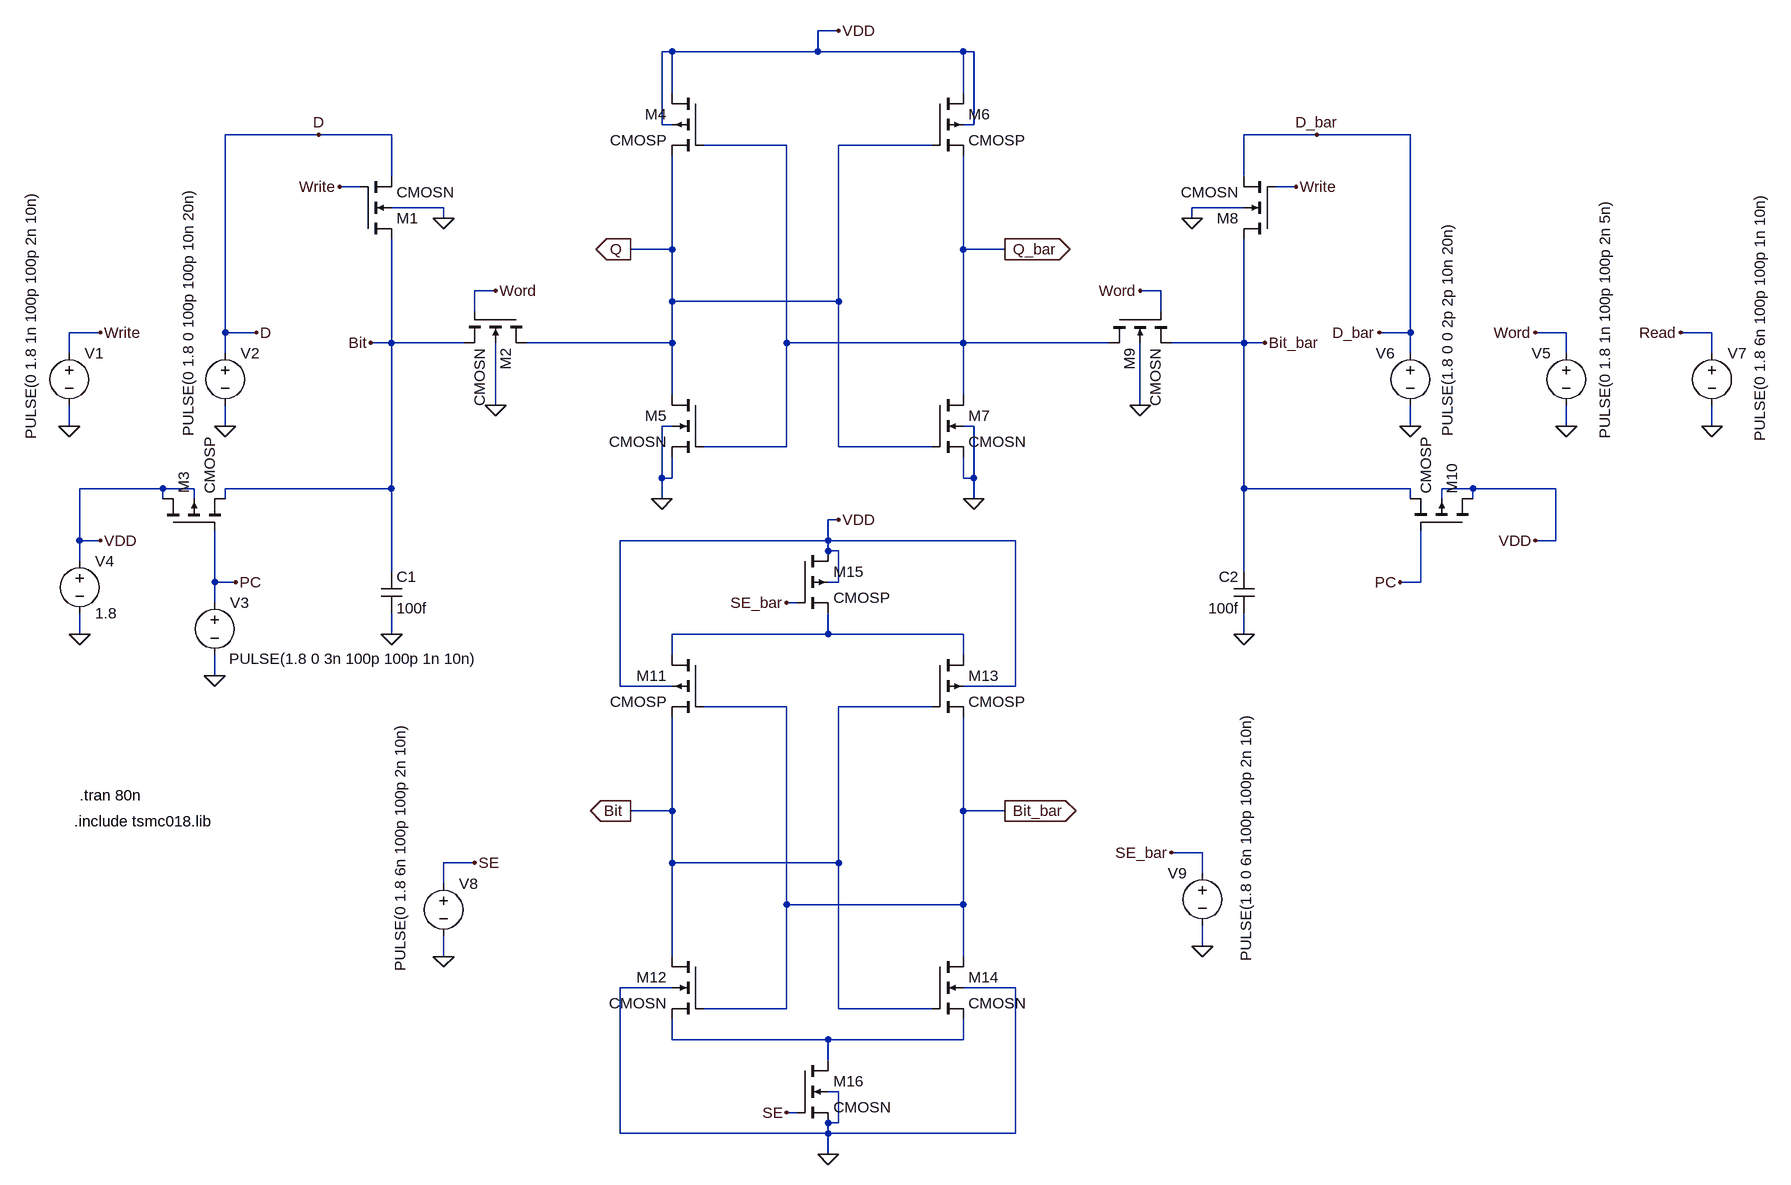
[diagram p0: schematic 1-bit_6T_SRAM_Cell_with_Sense_Amplifier.asc]
1-bit_6T_SRAM_Cell_with_Sense_Amplifier.asc, the LTspice schematic file:
Version 4.1
SHEET 1 2708 1256
WIRE 928 -640 896 -640
WIRE 672 -608 656 -608
WIRE 896 -608 896 -640
WIRE 896 -608 672 -608
WIRE 1120 -608 896 -608
WIRE 1136 -608 1120 -608
WIRE 672 -544 672 -608
WIRE 1120 -544 1120 -608
WIRE 656 -496 656 -608
WIRE 672 -496 656 -496
WIRE 1136 -496 1136 -608
WIRE 1136 -496 1120 -496
WIRE 128 -480 -16 -480
WIRE 240 -480 128 -480
WIRE 1664 -480 1552 -480
WIRE 1808 -480 1664 -480
WIRE 848 -464 720 -464
WIRE 1072 -464 928 -464
WIRE 240 -416 240 -480
WIRE 1552 -416 1552 -480
WIRE 192 -400 160 -400
WIRE 1632 -400 1600 -400
WIRE 320 -368 240 -368
WIRE 1552 -368 1472 -368
WIRE 320 -352 320 -368
WIRE 1472 -352 1472 -368
WIRE 672 -304 672 -448
WIRE 672 -304 608 -304
WIRE 1120 -304 1120 -448
WIRE 1184 -304 1120 -304
WIRE 400 -240 368 -240
WIRE 1424 -240 1392 -240
WIRE 672 -224 672 -304
WIRE 928 -224 928 -464
WIRE 928 -224 672 -224
WIRE 368 -208 368 -240
WIRE 1424 -208 1424 -240
WIRE -208 -176 -256 -176
WIRE -16 -176 -16 -480
WIRE 32 -176 -16 -176
WIRE 1808 -176 1808 -480
WIRE 1808 -176 1760 -176
WIRE 2048 -176 2000 -176
WIRE 2272 -176 2224 -176
WIRE 240 -160 240 -320
WIRE 240 -160 208 -160
WIRE 352 -160 240 -160
WIRE 672 -160 672 -224
WIRE 672 -160 448 -160
WIRE 848 -160 848 -464
WIRE 1120 -160 1120 -304
WIRE 1120 -160 848 -160
WIRE 1344 -160 1120 -160
WIRE 1552 -160 1552 -320
WIRE 1552 -160 1440 -160
WIRE 1584 -160 1552 -160
WIRE -256 -144 -256 -176
WIRE -16 -144 -16 -176
WIRE 1808 -144 1808 -176
WIRE 2048 -144 2048 -176
WIRE 2272 -144 2272 -176
WIRE 672 -80 672 -160
WIRE 1120 -80 1120 -160
WIRE 400 -64 400 -160
WIRE 1392 -64 1392 -160
WIRE -256 -32 -256 -64
WIRE -16 -32 -16 -64
WIRE 672 -32 656 -32
WIRE 1136 -32 1120 -32
WIRE 1808 -32 1808 -64
WIRE 2048 -32 2048 -64
WIRE 2272 -32 2272 -64
WIRE 848 0 848 -160
WIRE 848 0 720 0
WIRE 928 0 928 -224
WIRE 1072 0 928 0
WIRE 656 48 656 -32
WIRE 672 48 672 16
WIRE 672 48 656 48
WIRE 1120 48 1120 16
WIRE 1136 48 1136 -32
WIRE 1136 48 1120 48
WIRE -112 64 -240 64
WIRE -64 64 -112 64
WIRE 240 64 240 -160
WIRE 240 64 -16 64
WIRE 1552 64 1552 -160
WIRE 1808 64 1552 64
WIRE 1904 64 1856 64
WIRE 2032 64 1904 64
WIRE -112 80 -112 64
WIRE -64 80 -64 64
WIRE -16 80 -16 64
WIRE 656 80 656 48
WIRE 1136 80 1136 48
WIRE 1808 80 1808 64
WIRE 1856 80 1856 64
WIRE 1904 80 1904 64
WIRE 928 112 912 112
WIRE -240 144 -240 64
WIRE -208 144 -240 144
WIRE 912 144 912 112
WIRE 912 144 592 144
WIRE 1200 144 912 144
WIRE 2032 144 2032 64
WIRE 2032 144 2000 144
WIRE 912 160 912 144
WIRE 928 160 912 160
WIRE -240 176 -240 144
WIRE 240 192 240 64
WIRE 1552 192 1552 64
WIRE -32 208 -32 128
WIRE 0 208 -32 208
WIRE 928 208 928 160
WIRE 928 208 912 208
WIRE 1824 208 1824 128
WIRE 1824 208 1792 208
WIRE -32 240 -32 208
WIRE 864 240 848 240
WIRE -240 288 -240 256
WIRE 240 288 240 256
WIRE 912 288 912 256
WIRE 912 288 672 288
WIRE 1120 288 912 288
WIRE 1552 288 1552 256
WIRE 672 320 672 288
WIRE 1120 320 1120 288
WIRE -32 352 -32 320
WIRE 592 368 592 144
WIRE 672 368 592 368
WIRE 1200 368 1200 144
WIRE 1200 368 1120 368
WIRE 848 400 720 400
WIRE 1072 400 928 400
WIRE 672 560 672 416
WIRE 672 560 608 560
WIRE 1120 560 1120 416
WIRE 1184 560 1120 560
WIRE 1488 624 1440 624
WIRE 368 640 320 640
WIRE 672 640 672 560
WIRE 928 640 928 400
WIRE 928 640 672 640
WIRE 1488 656 1488 624
WIRE 320 672 320 640
WIRE 848 704 848 400
WIRE 1120 704 1120 560
WIRE 1120 704 848 704
WIRE 1488 768 1488 736
WIRE 320 784 320 752
WIRE 672 784 672 640
WIRE 1120 784 1120 704
WIRE 672 832 592 832
WIRE 1200 832 1120 832
WIRE 848 864 848 704
WIRE 848 864 720 864
WIRE 928 864 928 640
WIRE 1072 864 928 864
WIRE 672 912 672 880
WIRE 912 912 672 912
WIRE 1120 912 1120 880
WIRE 1120 912 912 912
WIRE 912 944 912 912
WIRE 928 992 912 992
WIRE 864 1024 848 1024
WIRE 928 1040 928 992
WIRE 928 1040 912 1040
WIRE 592 1056 592 832
WIRE 912 1056 912 1040
WIRE 912 1056 592 1056
WIRE 1200 1056 1200 832
WIRE 1200 1056 912 1056
WIRE 912 1088 912 1056
FLAG -208 -176 Write
FLAG 32 -176 D
FLAG -256 -32 0
FLAG -16 -32 0
FLAG 160 -400 Write
FLAG 320 -352 0
FLAG 128 -480 D
FLAG 400 -64 0
FLAG 400 -240 Word
FLAG -240 288 0
FLAG -32 352 0
FLAG 240 288 0
FLAG 0 208 PC
FLAG -208 144 VDD
FLAG 656 80 0
FLAG 1136 80 0
FLAG 608 -304 Q
IOPIN 608 -304 Out
FLAG 1184 -304 Q_bar
IOPIN 1184 -304 Out
FLAG 928 -640 VDD
FLAG 2000 -176 Word
FLAG 1760 -176 D_bar
FLAG 2048 -32 0
FLAG 1808 -32 0
FLAG 1632 -400 Write
FLAG 1472 -352 0
FLAG 1664 -480 D_bar
FLAG 1392 -64 0
FLAG 1392 -240 Word
FLAG 1552 288 0
FLAG 1792 208 PC
FLAG 2000 144 VDD
FLAG 2272 -32 0
FLAG 2224 -176 Read
FLAG 208 -160 Bit
FLAG 1584 -160 Bit_bar
FLAG 608 560 Bit
IOPIN 608 560 Out
FLAG 1184 560 Bit_bar
IOPIN 1184 560 Out
FLAG 848 240 SE_bar
FLAG 928 112 VDD
FLAG 848 1024 SE
FLAG 912 1088 0
FLAG 320 784 0
FLAG 368 640 SE
FLAG 1488 768 0
FLAG 1440 624 SE_bar
SYMBOL voltage -256 -160 R0
WINDOW 3 -59 148 VLeft 2
WINDOW 123 0 0 Left 0
WINDOW 39 0 0 Left 0
SYMATTR Value PULSE(0 1.8 1n 100p 100p 2n 10n)
SYMATTR InstName V1
SYMBOL voltage -16 -160 R0
WINDOW 3 -57 144 VLeft 2
WINDOW 123 0 0 Left 0
WINDOW 39 0 0 Left 0
SYMATTR Value PULSE(0 1.8 0 100p 100p 10n 20n)
SYMATTR InstName V2
SYMBOL nmos4 192 -320 M180
SYMATTR InstName M1
SYMATTR Value CMOSN
SYMATTR Value2 l=0.5u w=3u
SYMBOL nmos4 448 -208 R90
SYMATTR InstName M2
SYMATTR Value CMOSN
SYMATTR Value2 l=0.3u w=0.6u
SYMBOL cap 224 192 R0
SYMATTR InstName C1
SYMATTR Value 100f
SYMBOL voltage -32 224 R0
WINDOW 3 22 102 Left 2
WINDOW 123 0 0 Left 0
WINDOW 39 0 0 Left 0
SYMATTR Value PULSE(1.8 0 3n 100p 100p 1n 10n)
SYMATTR InstName V3
SYMBOL voltage -240 160 R0
WINDOW 123 0 0 Left 0
WINDOW 39 0 0 Left 0
SYMATTR InstName V4
SYMATTR Value 1.8
SYMBOL pmos4 -112 128 R270
SYMATTR InstName M3
SYMATTR Value CMOSP
SYMATTR Value2 l=0.5u w=2u
SYMBOL pmos4 720 -544 M0
SYMATTR InstName M4
SYMATTR Value CMOSP
SYMATTR Value2 l=0.3u w=0.39u
SYMBOL nmos4 720 -80 M0
SYMATTR InstName M5
SYMATTR Value CMOSN
SYMATTR Value2 l=0.3u w=1.5u
SYMBOL pmos4 1072 -544 R0
SYMATTR InstName M6
SYMATTR Value CMOSP
SYMATTR Value2 l=0.3u w=0.39u
SYMBOL nmos4 1072 -80 R0
SYMATTR InstName M7
SYMATTR Value CMOSN
SYMATTR Value2 l=0.3u w=1.5u
SYMBOL voltage 2048 -160 M0
WINDOW 3 -59 148 VLeft 2
WINDOW 123 0 0 Left 0
WINDOW 39 0 0 Left 0
SYMATTR Value PULSE(0 1.8 1n 100p 100p 2n 5n)
SYMATTR InstName V5
SYMBOL voltage 1808 -160 M0
WINDOW 3 -57 144 VLeft 2
WINDOW 123 0 0 Left 0
WINDOW 39 0 0 Left 0
SYMATTR Value PULSE(1.8 0 0 2p 2p 10n 20n)
SYMATTR InstName V6
SYMBOL nmos4 1600 -320 R180
SYMATTR InstName M8
SYMATTR Value CMOSN
SYMATTR Value2 l=0.5u w=3u
SYMBOL nmos4 1344 -208 M90
SYMATTR InstName M9
SYMATTR Value CMOSN
SYMATTR Value2 l=0.3u w=0.6u
SYMBOL cap 1568 192 M0
SYMATTR InstName C2
SYMATTR Value 100f
SYMBOL pmos4 1904 128 M270
SYMATTR InstName M10
SYMATTR Value CMOSP
SYMATTR Value2 l=0.5u w=2u
SYMBOL voltage 2272 -160 R0
WINDOW 3 74 151 VLeft 2
WINDOW 123 0 0 Left 0
WINDOW 39 0 0 Left 0
SYMATTR Value PULSE(0 1.8 6n 100p 100p 1n 10n)
SYMATTR InstName V7
SYMBOL pmos4 720 320 M0
SYMATTR InstName M11
SYMATTR Value CMOSP
SYMATTR Value2 l=0.5u w=2u
SYMBOL nmos4 720 784 M0
SYMATTR InstName M12
SYMATTR Value CMOSN
SYMATTR Value2 l=0.5u w=1u
SYMBOL pmos4 1072 320 R0
SYMATTR InstName M13
SYMATTR Value CMOSP
SYMATTR Value2 l=0.5u w=2u
SYMBOL nmos4 1072 784 R0
SYMATTR InstName M14
SYMATTR Value CMOSN
SYMATTR Value2 l=0.5u w=1u
SYMBOL pmos4 864 160 R0
SYMATTR InstName M15
SYMATTR Value CMOSP
SYMATTR Value2 l=0.5u w=1u
SYMBOL nmos4 864 944 R0
SYMATTR InstName M16
SYMATTR Value CMOSN
SYMATTR Value2 l=0.5u w=3u
SYMBOL voltage 320 656 R0
WINDOW 3 -67 151 VLeft 2
WINDOW 123 0 0 Left 0
WINDOW 39 0 0 Left 0
SYMATTR Value PULSE(0 1.8 6n 100p 100p 2n 10n)
SYMATTR InstName V8
SYMBOL voltage 1488 640 M0
WINDOW 3 -67 151 VLeft 2
WINDOW 123 0 0 Left 0
WINDOW 39 0 0 Left 0
SYMATTR Value PULSE(1.8 0 6n 100p 100p 2n 10n)
SYMATTR InstName V9
TEXT -248 576 Left 2 !.include tsmc018.lib
TEXT -240 536 Left 2 !.tran 80n

The netlist it stands for:
* 1-bit_6T_SRAM_Cell_with_Sense_Amplifier.asc
V1 Write 0 PULSE(0 1.8 1n 100p 100p 2n 10n)
V2 D 0 PULSE(0 1.8 0 100p 100p 10n 20n)
M1 Bit Write D 0 CMOSN l=0.5u w=3u
M2 Q Word Bit 0 CMOSN l=0.3u w=0.6u
C1 Bit 0 100f
V3 PC 0 PULSE(1.8 0 3n 100p 100p 1n 10n)
V4 VDD 0 1.8
M3 VDD PC Bit VDD CMOSP l=0.5u w=2u
M4 VDD Q_bar Q VDD CMOSP l=0.3u w=0.39u
M5 Q Q_bar 0 0 CMOSN l=0.3u w=1.5u
M6 VDD Q Q_bar VDD CMOSP l=0.3u w=0.39u
M7 Q_bar Q 0 0 CMOSN l=0.3u w=1.5u
V5 Word 0 PULSE(0 1.8 1n 100p 100p 2n 5n)
V6 D_bar 0 PULSE(1.8 0 0 2p 2p 10n 20n)
M8 Bit_bar Write D_bar 0 CMOSN l=0.5u w=3u
M9 Q_bar Word Bit_bar 0 CMOSN l=0.3u w=0.6u
C2 Bit_bar 0 100f
M10 VDD PC Bit_bar VDD CMOSP l=0.5u w=2u
V7 Read 0 PULSE(0 1.8 6n 100p 100p 1n 10n)
M11 N001 Bit_bar Bit VDD CMOSP l=0.5u w=2u
M12 Bit Bit_bar N002 0 CMOSN l=0.5u w=1u
M13 N001 Bit Bit_bar VDD CMOSP l=0.5u w=2u
M14 Bit_bar Bit N002 0 CMOSN l=0.5u w=1u
M15 VDD SE_bar N001 VDD CMOSP l=0.5u w=1u
M16 N002 SE 0 0 CMOSN l=0.5u w=3u
V8 SE 0 PULSE(0 1.8 6n 100p 100p 2n 10n)
V9 SE_bar 0 PULSE(1.8 0 6n 100p 100p 2n 10n)
.model NMOS NMOS
.model PMOS PMOS
.lib standard.mos
.include tsmc018.lib
.tran 80n
.backanno
.end